# EAGLE design sensor-xmegab3 (EAGLE 6.4)
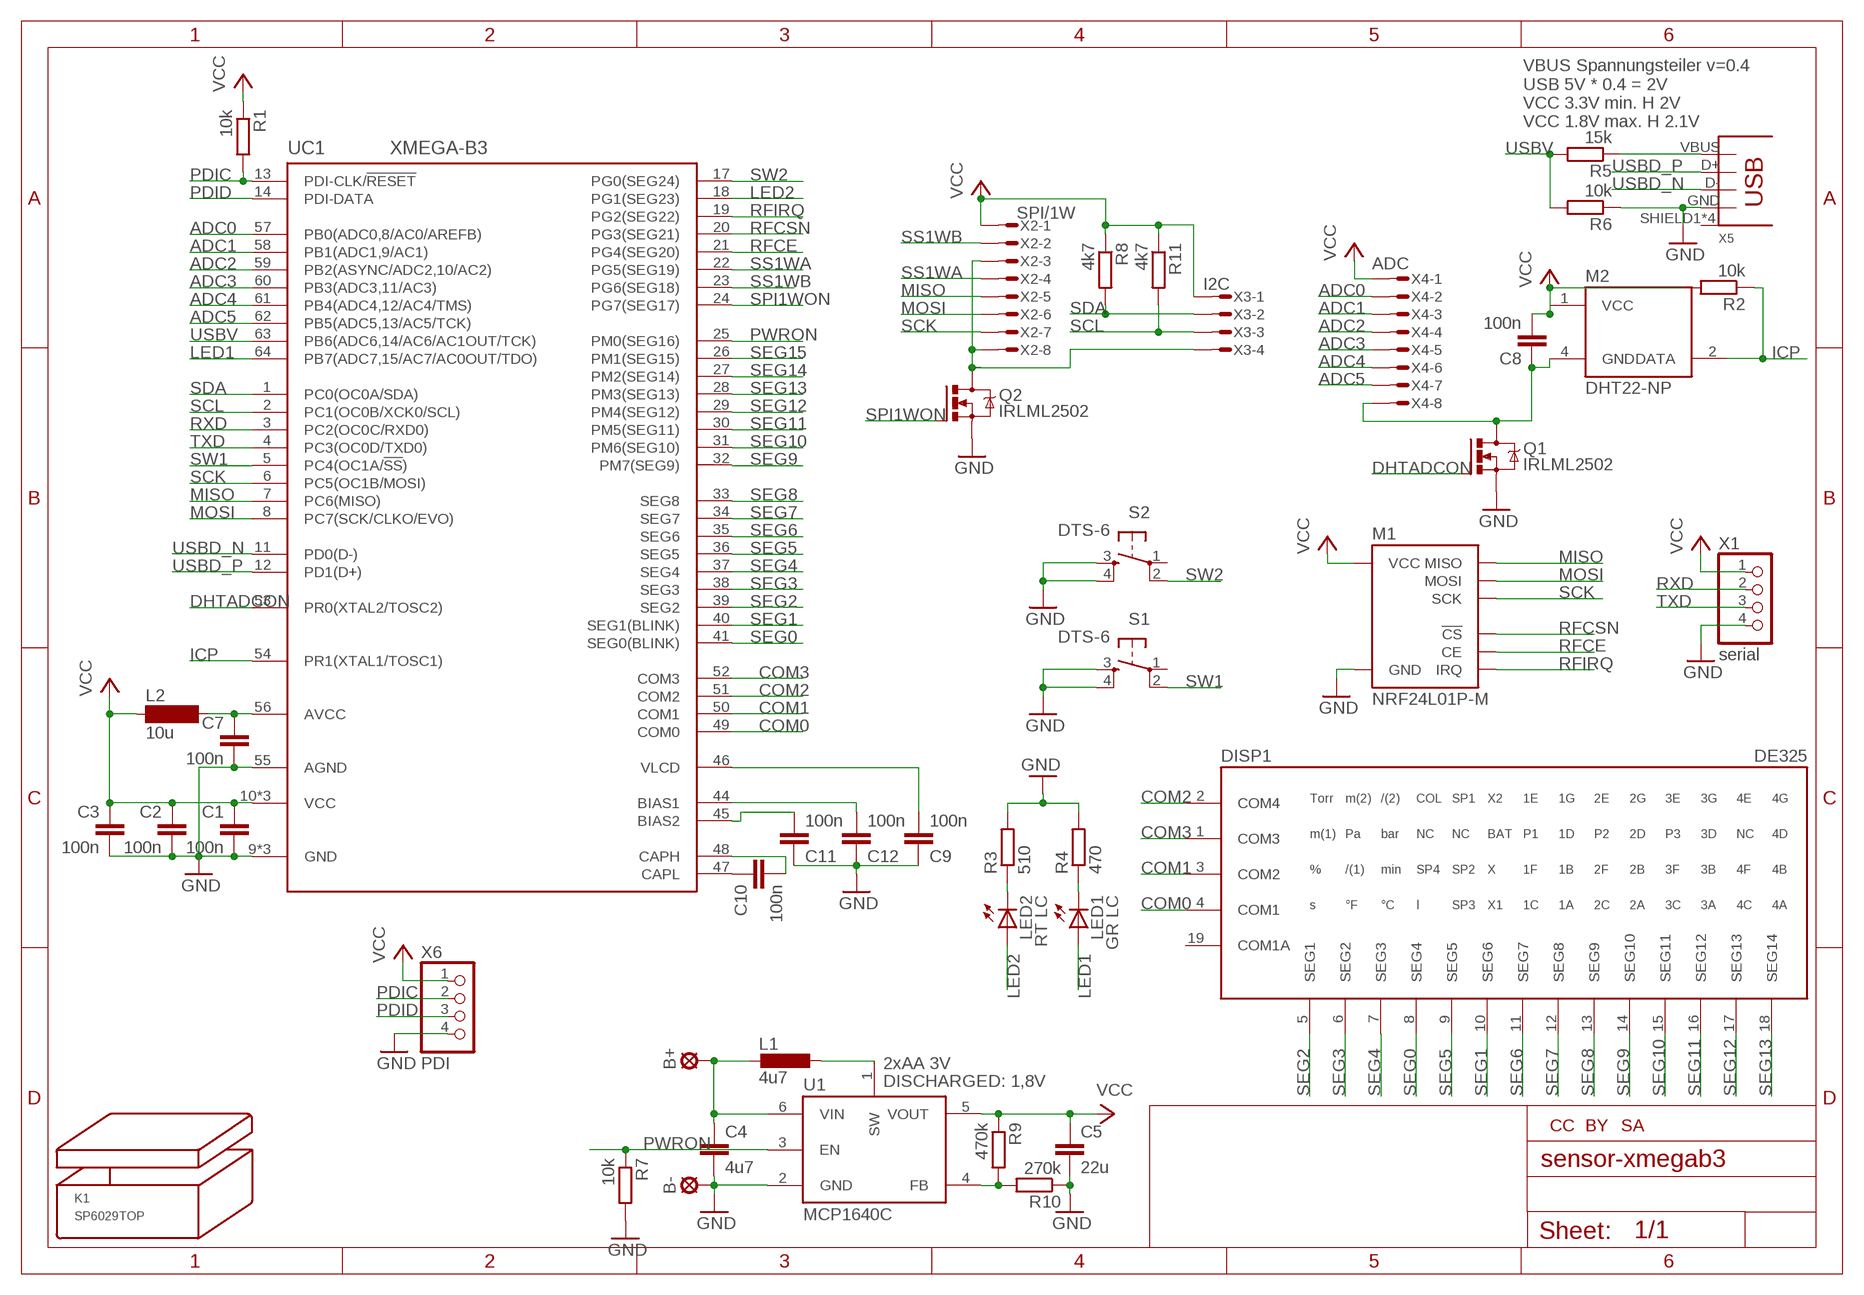
[diagram p0: schematic, sheet 1]

## Parts
B+  LSP11  [LSP11]
B-  LSP11  [LSP11]
C1  100n  C-EUC0603  [C0603]
C2  100n  C-EUC0603  [C0603]
C3  100n  C-EUC0603  [C0603]
C4  4u7  C-EUC0805  [C0805]
C5  22u  C-EUC1206  [C1206]
C7  100n  C-EUC0603  [C0603]
C8  100n  C-EUC0603  [C0603]
C9  100n  C-EUC0603  [C0603]
C10  100n  C-EUC0603  [C0603]
C11  100n  C-EUC0603  [C0603]
C12  100n  C-EUC0603  [C0603]
DISP1  DE325  [DE325]
K1  SP6029TOP  [SP6029T]
L1  4u7  L-EUPISG  [PISG]
L2  10u  SM-NE29  [SM-NE29]
LED1  GR LC  LED5MM  [LED5MM]
LED2  RT LC  LED5MM  [LED5MM]
M1  NRF24L01P-M  [NRF24L01P-A]
M2  DHT22-NP  [DHT22-NOPRINT]
Q1  IRLML2502  [MICRO3]
Q2  IRLML2502  [MICRO3]
R1  10k  R-EU_R0603  [R0603]
R2  10k  R-EU_R0603  [R0603]
R3  510  R-EU_R0805  [R0805]
R4  470  R-EU_R0805  [R0805]
R5  15k  R-EU_R0603  [R0603]
R6  10k  R-EU_R0603  [R0603]
R7  10k  R-EU_R0603  [R0603]
R8  4k7  R-EU_R0603  [R0603]
R9  470k  R-EU_R0603  [R0603]
R10  270k  R-EU_R0603  [R0603]
R11  4k7  R-EU_R0603  [R0603]
S1  DTS-6  [DTS-6]
S2  DTS-6  [DTS-6]
U1  MCP1640C  MCP1640  [SOT23-6]
U$1  CC-TPLACE-HALF  [CC_TPLACE_HS]
U$3  BY-TPLACE-HS  [BY_TPLACE_HS]
U$4  SA-TPLACE-HALF  [SA_TPLACE_HS]
UC1  XMEGA-B3  [TQFP64]
X1  serial  PINHD-1X4_2.54  [1X04]
X2  SPI/1W  MICROMATCH-8  [MICROMATCH-8]
X3  I2C  MICROMATCH-4  [MICROMATCH-4]
X4  ADC  MICROMATCH-8  [MICROMATCH-8]
X5  USB  USB-MB-S  [USB-MB-S]
X6  PDI  PINHD-1X4_2.54  [1X04]

## Nets
ADC0: UC1.57(PB0(ADC0,8/AC0/AREFB)) X4.2
ADC1: UC1.58(PB1(ADC1,9/AC1)) X4.3
ADC2: UC1.59(PB2(ASYNC/ADC2,10/AC2)) X4.4
ADC3: UC1.60(PB3(ADC3,11/AC3)) X4.5
ADC4: UC1.61(PB4(ADC4,12/AC4/TMS)) X4.6
ADC5: UC1.62(PB5(ADC5,13/AC5/TCK)) X4.7
AVCC: C7.1 L2.2 UC1.56(AVCC)
COM0: DISP1.4(COM1) UC1.49(COM0)
COM1: DISP1.3(COM2) UC1.50(COM1)
COM2: DISP1.2(COM4) UC1.51(COM2)
COM3: DISP1.1(COM3) UC1.52(COM3)
DHTADCON: Q1.1(G) UC1.53(PR0(XTAL2/TOSC2))
GND: B-.MP C1.2 C2.2 C3.2 C4.2 C5.2 C7.2 C9.1 C11.1 C12.1 M1.GND_A(GND) M1.GND_B(GND) Q1.2(S) Q2.2(S) R3.2 R4.2 R6.1 R7.2 R10.1 S1.3 S1.4 S2.3 S2.4 U1.2(GND) UC1.9(GND) UC1.15(GND) UC1.42(GND) UC1.55(AGND) X1.4 X5.GND X6.4
ICP: M2.2(DATA) R2.1 UC1.54(PR1(XTAL1/TOSC1))
LED1: LED1.A UC1.64(PB7(ADC7,15/AC7/AC0OUT/TDO))
LED2: LED2.A UC1.18(PG1(SEG23))
MISO: M1.MISO UC1.7(PC6(MISO)) X2.5
MOSI: M1.MOSI UC1.8(PC7(SCK/CLKO/EVO)) X2.6
N$1: LED1.K(C) R4.1
N$3: R5.1 X5.VBUS
N$6: LED2.K(C) R3.1
N$7: L1.1 U1.1(SW)
N$8: R9.2 R10.2 U1.4(FB)
N$9: C11.2 UC1.45(BIAS2)
N$10: C12.2 UC1.44(BIAS1)
N$11: Q2.3(D) X2.3 X2.8 X3.4
N$12: C8.1 M2.4(GND) Q1.3(D) X4.8
N$14: C9.2 UC1.46(VLCD)
N$23: C10.1 UC1.47(CAPL)
N$25: C10.2 UC1.48(CAPH)
PDIC: R1.2 UC1.13(PDI-CLK/!RESET) X6.2
PDID: UC1.14(PDI-DATA) X6.3
PWRON: R7.1 U1.3(EN) UC1.25(PM0(SEG16))
RFCE: M1.CE UC1.21(PG4(SEG20))
RFCSN: M1.CSN(!CS) UC1.20(PG3(SEG21))
RFIRQ: M1.IRQ UC1.19(PG2(SEG22))
RXD: UC1.3(PC2(OC0C/RXD0)) X1.2
SCK: M1.SCK UC1.6(PC5(OC1B/MOSI)) X2.7
SCL: R11.2 UC1.2(PC1(OC0B/XCK0/SCL)) X3.3
SDA: R8.2 UC1.1(PC0(OC0A/SDA)) X3.2
SEG0: DISP1.8(SEG4) UC1.41(SEG0(BLINK))
SEG1: DISP1.10(SEG6) UC1.40(SEG1(BLINK))
SEG2: DISP1.5(SEG1) UC1.39(SEG2)
SEG3: DISP1.6(SEG2) UC1.38(SEG3)
SEG4: DISP1.7(SEG3) UC1.37(SEG4)
SEG5: DISP1.9(SEG5) UC1.36(SEG5)
SEG6: DISP1.11(SEG7) UC1.35(SEG6)
SEG7: DISP1.12(SEG8) UC1.34(SEG7)
SEG8: DISP1.13(SEG9) UC1.33(SEG8)
SEG9: DISP1.14(SEG10) UC1.32(PM7(SEG9))
SEG10: DISP1.15(SEG11) UC1.31(PM6(SEG10))
SEG11: DISP1.16(SEG12) UC1.30(PM5(SEG11))
SEG12: DISP1.17(SEG13) UC1.29(PM4(SEG12))
SEG13: DISP1.18(SEG14) UC1.28(PM3(SEG13))
SEG14: UC1.27(PM2(SEG14))
SEG15: UC1.26(PM1(SEG15))
SPI1WON: Q2.1(G) UC1.24(PG7(SEG17))
SS1WA: UC1.22(PG5(SEG19)) X2.4
SS1WB: UC1.23(PG6(SEG18)) X2.2
SW1: S1.2 UC1.5(PC4(OC1A/!SS!))
SW2: S2.2 UC1.17(PG0(SEG24))
TXD: UC1.4(PC3(OC0D/TXD0)) X1.3
USBD_N: UC1.11(PD0(D-)) X5.D-
USBD_P: UC1.12(PD1(D+)) X5.D+
USBV: R5.2 R6.2 UC1.63(PB6(ADC6,14/AC6/AC1OUT/TCK))
VBAT: B+.MP C4.1 L1.2 U1.6(VIN)
VCC: C1.1 C2.1 C3.1 C5.1 C8.2 L2.1 M1.VCC_A(VCC) M1.VCC_B(VCC) M2.1(VCC) R1.1 R2.2 R8.1 R9.1 R11.1 U1.5(VOUT) UC1.10(VCC) UC1.16(VCC) UC1.43(VCC) X1.1 X2.1 X3.1 X4.1 X6.1
Unconnected: DISP1.19(COM1A) S1.1 S2.1 X5.SHIELD1(SHIELD) X5.SHIELD2(SHIELD) X5.SHIELD3(SHIELD) X5.SHIELD4(SHIELD)

## Notes on the sheet
- VBUS Spannungsteiler v=0.4
  USB 5V * 0.4 = 2V
  VCC 3.3V min. H 2V
  VCC 1.8V max. H 2.1V
- 2xAA 3V
- DISCHARGED: 1,8V

## Library data of the parts
B+ B- = solpad:LSP11: SOLDER PAD drill 1.1 mm
C1-C3 C7-C12 = rcl:C-EU: CAPACITOR, European symbol
C4 = rcl:C-EU: CAPACITOR, European symbol; _REICHELT_: X7R-G0805 4,7/16
C5 = rcl:C-EU: CAPACITOR, European symbol; _REICHELT_: X7R-G1206 22/10
DISP1 = lcd_displays:DE325: Display Elektronik GmbH DE325-Series Datasheet: http://display-elektronik.de/DE325-RS-20_843V.PDF
K1 = strapubox:SP6029: Gehäuse Strapubox Typ 6029 Montage Deckel max. Bauteilhöhe, top-layer: 7,5 mm max. Bauteilhöhe, bottom-layer: 10 mm (Dicke der LP: 1,5 mm) Montage Boden max. Bauteilhöhe, top-layer: 12,5 mm max. Bauteilhöhe, bottom-layer: 5 mm (Dicke der LP: 1,5 mm) Außenmaße: Länge: 80 mm Breite: 61 mm Höhe: 23 mm Innenmaße: Länge: 75 mm Breite: 56 mm Höhe: 19 mm Mit Batteriefach 2xAA/9V
L1 = inductor-Fastron:L-EU; _REICHELT_: L-PISG 4,7µ
L2 = inductor-neosid:SM-NE29: INDUCTOR SMD chip inductor; OC_FARNELL: unknown; OC_NEWARK: unknown
LED1 = led:LED: LED OSRAM: - CHIPLED LG R971, LG N971, LY N971, LG Q971, LY Q971, LO R971, LY R971 LH N974, LH R974 LS Q976, LO Q976, LY Q976 LO Q996 - Hyper CHIPLED LW Q18S LB Q993, LB Q99A, LB R99A - SideLED LS A670, LO A670, LY A670, LG A670, LP A670 LB A673, LV A673, LT A673, LW A673 LH A674 LY A675 LS A676, LA A676, LO A676, LY A676, LW A676 LS A679, LY A679, LG A679 - Hyper Micro SIDELED® LS Y876, LA Y876, LO Y876, LY Y876 LT Y87S - SmartLED LW L88C, LW L88S LB L89C, LB L89S, LG L890 LS L89K, LO L89K, LY L89K LS L896, LA L896, LO L896, LY L896 - TOPLED LS T670, LO T670, LY T670, LG T670, LP T670 LSG T670, LSP T670, LSY T670, LOP T670, LYG T670 LG T671, LOG T671, LSG T671 LB T673, LV T673, LT T673, LW T673 LH T674 LS T676, LA T676, LO T676, LY T676, LB T676, LH T676, LSB T676, LW T676 LB T67C, LV T67C, LT T67C, LS T67K, LO T67K, LY T67K, LW E67C LS E67B, LA E67B, LO E67B, LY E67B, LB E67C, LV E67C, LT E67C LW T67C LS T679, LY T679, LG T679 LS T770, LO T770, LY T770, LG T770, LP T770 LB T773, LV T773, LT T773, LW T773 LH T774 LS E675, LA E675, LY E675, LS T675 LS T776, LA T776, LO T776, LY T776, LB T776 LHGB T686 LT T68C, LB T68C - Hyper Mini TOPLED® LB M676 - Mini TOPLED Santana® LG M470 LS M47K, LO M47K, LY M47K Source: http://www.osram.convergy.de LUXEON: - LUMILED® LXK2-PW12-R00, LXK2-PW12-S00, LXK2-PW14-U00, LXK2-PW14-V00 LXK2-PM12-R00, LXK2-PM12-S00, LXK2-PM14-U00 LXK2-PE12-Q00, LXK2-PE12-R00, LXK2-PE12-S00, LXK2-PE14-T00, LXK2-PE14-U00 LXK2-PB12-K00, LXK2-PB12-L00, LXK2-PB12-M00, LXK2-PB14-N00, LXK2-PB14-P00, LXK2-PB14-Q00 LXK2-PR12-L00, LXK2-PR12-M00, LXK2-PR14-Q00, LXK2-PR14-R00 LXK2-PD12-Q00, LXK2-PD12-R00, LXK2-PD12-S00 LXK2-PH12-R00, LXK2-PH12-S00 LXK2-PL12-P00, LXK2-PL12-Q00, LXK2-PL12-R00 Source: www.luxeon.com KINGBRIGHT: KA-3528ASYC Source: www.kingbright.com; I: 2.2mA; U_F: 2V2
LED2 = led:LED: LED OSRAM: - CHIPLED LG R971, LG N971, LY N971, LG Q971, LY Q971, LO R971, LY R971 LH N974, LH R974 LS Q976, LO Q976, LY Q976 LO Q996 - Hyper CHIPLED LW Q18S LB Q993, LB Q99A, LB R99A - SideLED LS A670, LO A670, LY A670, LG A670, LP A670 LB A673, LV A673, LT A673, LW A673 LH A674 LY A675 LS A676, LA A676, LO A676, LY A676, LW A676 LS A679, LY A679, LG A679 - Hyper Micro SIDELED® LS Y876, LA Y876, LO Y876, LY Y876 LT Y87S - SmartLED LW L88C, LW L88S LB L89C, LB L89S, LG L890 LS L89K, LO L89K, LY L89K LS L896, LA L896, LO L896, LY L896 - TOPLED LS T670, LO T670, LY T670, LG T670, LP T670 LSG T670, LSP T670, LSY T670, LOP T670, LYG T670 LG T671, LOG T671, LSG T671 LB T673, LV T673, LT T673, LW T673 LH T674 LS T676, LA T676, LO T676, LY T676, LB T676, LH T676, LSB T676, LW T676 LB T67C, LV T67C, LT T67C, LS T67K, LO T67K, LY T67K, LW E67C LS E67B, LA E67B, LO E67B, LY E67B, LB E67C, LV E67C, LT E67C LW T67C LS T679, LY T679, LG T679 LS T770, LO T770, LY T770, LG T770, LP T770 LB T773, LV T773, LT T773, LW T773 LH T774 LS E675, LA E675, LY E675, LS T675 LS T776, LA T776, LO T776, LY T776, LB T776 LHGB T686 LT T68C, LB T68C - Hyper Mini TOPLED® LB M676 - Mini TOPLED Santana® LG M470 LS M47K, LO M47K, LY M47K Source: http://www.osram.convergy.de LUXEON: - LUMILED® LXK2-PW12-R00, LXK2-PW12-S00, LXK2-PW14-U00, LXK2-PW14-V00 LXK2-PM12-R00, LXK2-PM12-S00, LXK2-PM14-U00 LXK2-PE12-Q00, LXK2-PE12-R00, LXK2-PE12-S00, LXK2-PE14-T00, LXK2-PE14-U00 LXK2-PB12-K00, LXK2-PB12-L00, LXK2-PB12-M00, LXK2-PB14-N00, LXK2-PB14-P00, LXK2-PB14-Q00 LXK2-PR12-L00, LXK2-PR12-M00, LXK2-PR14-Q00, LXK2-PR14-R00 LXK2-PD12-Q00, LXK2-PD12-R00, LXK2-PD12-S00 LXK2-PH12-R00, LXK2-PH12-S00 LXK2-PL12-P00, LXK2-PL12-Q00, LXK2-PL12-R00 Source: www.luxeon.com KINGBRIGHT: KA-3528ASYC Source: www.kingbright.com; I: 2mA; U_F: 2V
M1 = modules:NRF24L01P-M
M2 = modules:DHT22
Q1 Q2 = mosfet:IRLML2502: HEXFET N-Channel Power MOSFET http://www.irf.com/product-info/datasheets/data/irlml2502.pdf
R1-R11 = rcl:R-EU_: RESISTOR, European symbol
S1 S2 = switch-tact:DTS-6
U1 = karlnet-parts:MCP1640: MCP1623, 1624, 1640/B/C/D pwm/pfm or pwm only DC/DC converters, in SOT-23
U$1 = creative-commons:CC: creatice commons - CC
U$3 = creative-commons:BY: creative commons Attribution - BY
U$4 = creative-commons:SA: creative commons ShareAlike - SA
UC1 = avr-7:XMEGA-B3: Atmel XMega B3 series processor
X1 X6 = pinhead-mod:PINHD-1X4: PIN HEADER
X2 X4 = con-amp-micromatch:MICROMATCH-8: MicroMaTch 8 7-215464-8 / 0-215464-8 Drawing Number C-215464 DDEController.pdf
X3 = con-amp-micromatch:MICROMATCH-4: MicroMaTch 4 7-215464-4 / 0-215464-4 Drawing Number C-215464 DDEController.pdf
X5 = con-usb:USB: USB Connectors

## Board
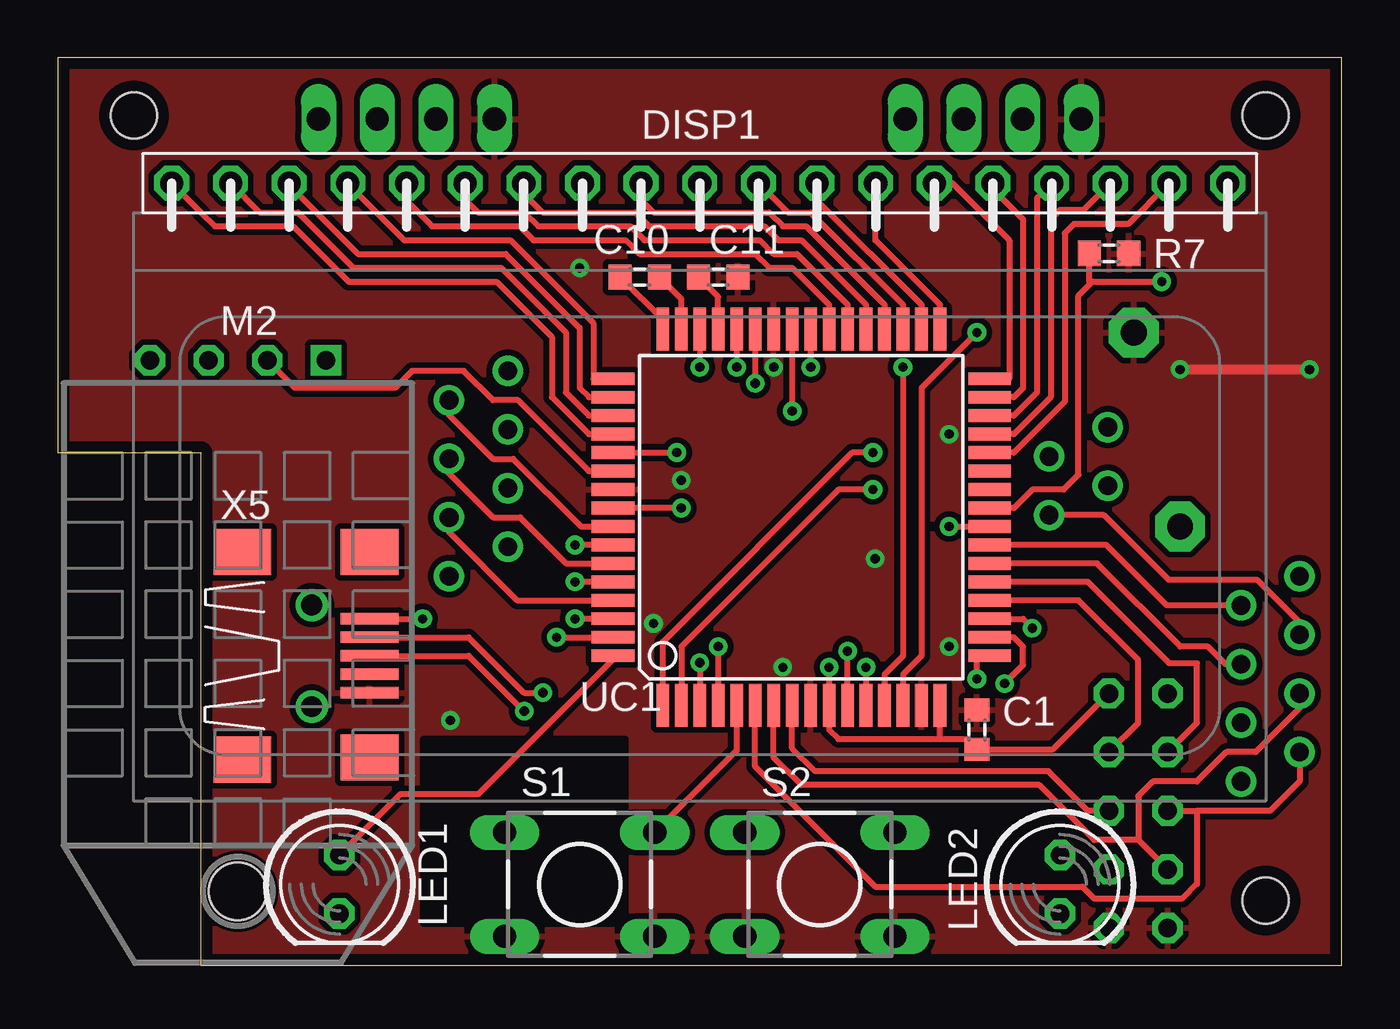
[diagram p1: board, top side]
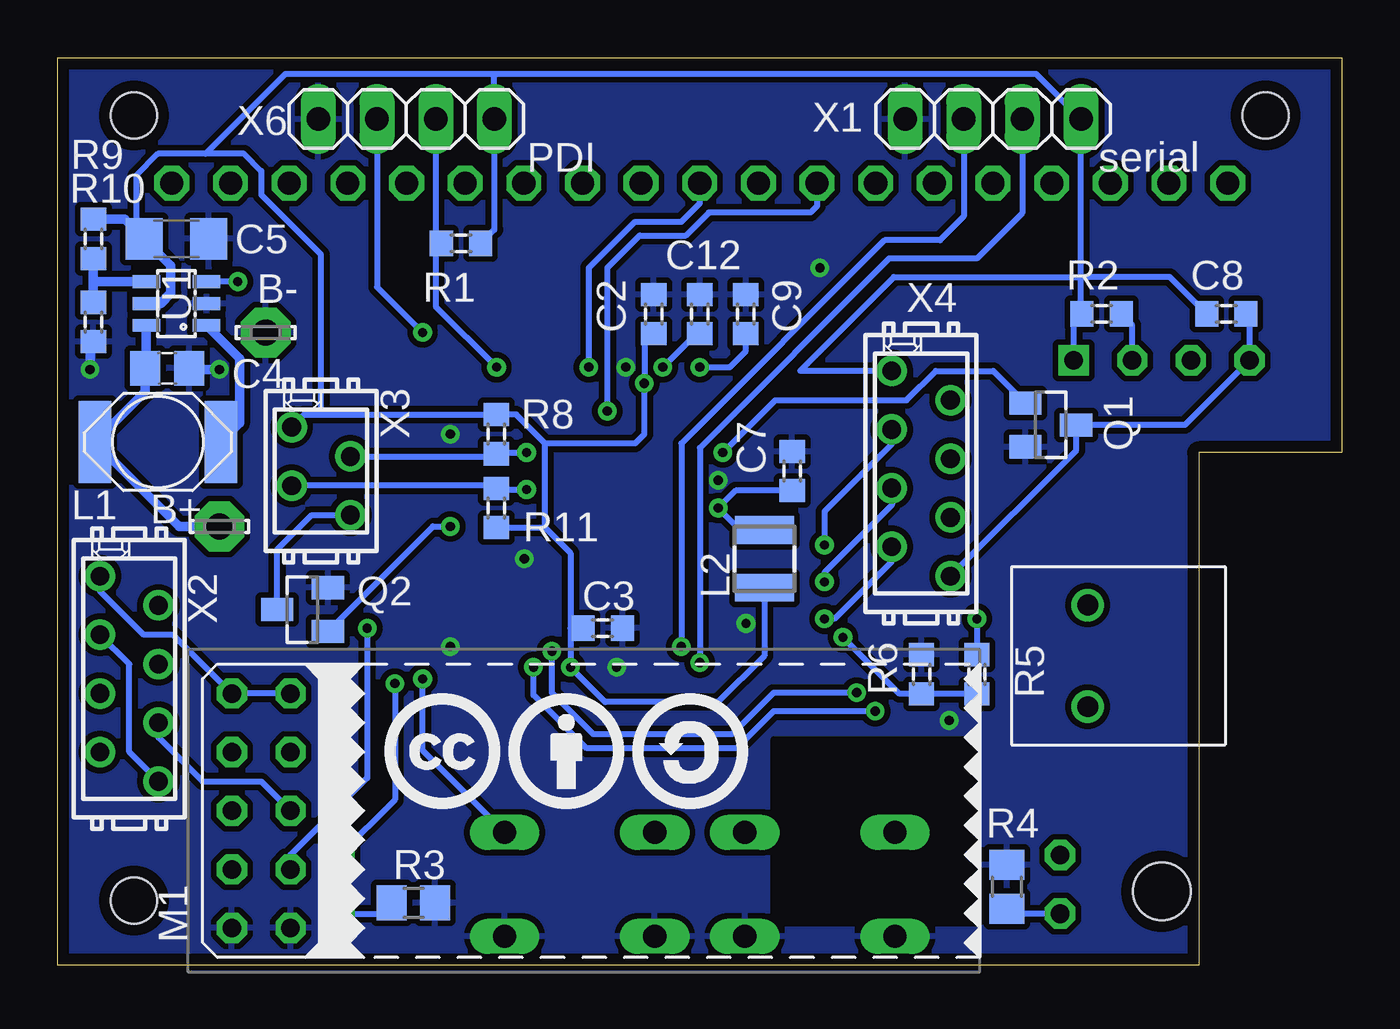
[diagram p2: board, bottom side, seen from below]

Size 55.6 x 39.3 mm. Coordinates in mm from the lower left corner, seen from the top.
Outline: 6.2,22.2 6.2,0 55.6,0 55.6,39.3 0,39.3 0,22.2 6.2,22.2
Copper layers (1*16): Top 0.035mm / dielectric 1.5mm / Bottom 0.035mm
Design rules "bilex-cust *": minimum track width 10mil, minimum drill 0.4mm, track to track 10mil, track to pad 10mil, pad to pad 0.251459375mm, via to via 10mil, smd to smd 0.251459375mm, copper to edge 0.5mm, drill to drill 8mil, minimum pad ring 10mil, minimum via ring 8mil, stop-mask expansion 4mil, vias tented up to drill 0mil, thermal gap 10mil
Holes 2 mm at 52.3,2.8 52.3,36.8 3.3,36.8
Holes 2.5 mm at 7.8,3.2

### Footprints (pad centres in the part's own frame; a part is rotated, then mirrored left to right if it is on the bottom)
LSP11 = drill 1.118 pad 2.159 octagon: MP 0,0
C0603 = smd 1 x 1.1: 1 -0.85,0; 2 0.85,0
C0805 = smd 1.3 x 1.5: 1 -0.95,0; 2 0.95,0
C1206 = smd 1.6 x 1.8: 1 -1.4,0; 2 1.4,0
DE325 = drill 1 octagon: 1 -22.86,1.27; 2 -20.32,1.27; 3 -17.78,1.27; 4 -15.24,1.27; 5 -12.7,1.27; 6 -10.16,1.27; 7 -7.62,1.27; 8 -5.08,1.27; 9 -2.54,1.27; 10 0,1.27; 11 2.54,1.27; 12 5.08,1.27; 13 7.62,1.27; 14 10.16,1.27; 15 12.7,1.27; 16 15.24,1.27; 17 17.78,1.27; 18 20.32,1.27; 19 22.86,1.27
PISG = smd 1.4 x 3.56: 1 -2.73,0; 2 2.73,0
SM-NE29 = smd 1.2 x 2.54: 1 -1.25,0; 2 1.25,0
LED5MM = drill 0.813 octagon: A -1.27,0; K 1.27,0
NRF24L01P-A = drill 0.8 octagon: CE -2.54,-1.27; CSN -2.54,1.27; GND_A 5.08,1.27; GND_B 5.08,-1.27; IRQ 2.54,1.27; MISO 2.54,-1.27; MOSI 0,1.27; SCK 0,-1.27; VCC_A -5.08,1.27; VCC_B -5.08,-1.27
DHT22-NOPRINT = drill 0.8 square: 1 -3.81,0 | drill 0.8 octagon: 2 -1.27,0; 3 1.27,0; 4 3.81,0
MICRO3 = smd 1 x 1.4: 1 -0.95,-1.1; 2 0.95,-1.1; 3 0,1.1
R0603 = smd 1 x 1.1: 1 -0.85,0; 2 0.85,0
R0805 = smd 1.3 x 1.5: 1 -0.95,0; 2 0.95,0
DTS-6 = drill 1 long: 1 -3.25,2.25; 2 3.25,2.25; 3 -3.25,-2.25; 4 3.25,-2.25
SOT23-6 = smd 0.55 x 1.2: 1 -0.95,-1.3; 2 0,-1.3; 3 0.95,-1.3; 4 0.95,1.3; 5 0,1.3; 6 -0.95,1.3
TQFP64 = smd 1.85 x 0.55: 1 -8.15,6; 2 -8.15,5.2; 3 -8.15,4.4; 4 -8.15,3.6; 5 -8.15,2.8; 6 -8.15,2; 7 -8.15,1.2; 8 -8.15,0.4; 9 -8.15,-0.4; 10 -8.15,-1.2; 11 -8.15,-2; 12 -8.15,-2.8; 13 -8.15,-3.6; 14 -8.15,-4.4; 15 -8.15,-5.2; 16 -8.15,-6; 33 8.15,-6; 34 8.15,-5.2; 35 8.15,-4.4; 36 8.15,-3.6; 37 8.15,-2.8; 38 8.15,-2; 39 8.15,-1.2; 40 8.15,-0.4; 41 8.15,0.4; 42 8.15,1.2; 43 8.15,2; 44 8.15,2.8; 45 8.15,3.6; 46 8.15,4.4; 47 8.15,5.2; 48 8.15,6 | smd 0.55 x 1.85: 17 -6,-8.15; 18 -5.2,-8.15; 19 -4.4,-8.15; 20 -3.6,-8.15; 21 -2.8,-8.15; 22 -2,-8.15; 23 -1.2,-8.15; 24 -0.4,-8.15; 25 0.4,-8.15; 26 1.2,-8.15; 27 2,-8.15; 28 2.8,-8.15; 29 3.6,-8.15; 30 4.4,-8.15; 31 5.2,-8.15; 32 6,-8.15; 49 6,8.15; 50 5.2,8.15; 51 4.4,8.15; 52 3.6,8.15; 53 2.8,8.15; 54 2,8.15; 55 1.2,8.15; 56 0.4,8.15; 57 -0.4,8.15; 58 -1.2,8.15; 59 -2,8.15; 60 -2.8,8.15; 61 -3.6,8.15; 62 -4.4,8.15; 63 -5.2,8.15; 64 -6,8.15
1X04 = drill 1.016 long: 1 -3.81,0; 2 -1.27,0; 3 1.27,0; 4 3.81,0
MICROMATCH-8 = drill 0.813: 1 4.445,1.27; 2 3.175,-1.27; 3 1.905,1.27; 4 0.635,-1.27; 5 -0.635,1.27; 6 -1.905,-1.27; 7 -3.175,1.27; 8 -4.445,-1.27
MICROMATCH-4 = drill 0.813: 1 1.905,1.27; 2 0.635,-1.27; 3 -0.635,1.27; 4 -1.905,-1.27
USB-MB-S = smd 2.5 x 0.5: D+ 2.5,0; D- 2.5,0.8; GND 2.5,-1.6; ID 2.5,-0.8; VBUS 2.5,1.6 | drill 0.9: P$5 0,2.2; P$6 0,-2.2 | smd 2.5 x 2: SHIELD1 -3,4.5; SHIELD2 2.5,4.5; SHIELD3 -3,-4.5; SHIELD4 2.5,-4.4

### Placement (x,y rotation side)
B+  48.6,19 180 bottom
B-  46.6,27.4 0 bottom
C1  39.8,10.2 90 top
C2  29.8,28.2 90 bottom
C3  32,14.6 0 bottom
C4  50.86,25.86 0 bottom
C5  50.46,31.46 0 bottom
C7  23.8,21.4 90 bottom
C8  5,28.2 180 bottom
C9  25.8,28.2 270 bottom
C10  25.2,29.8 180 top
C11  28.6,29.8 180 top
C12  27.8,28.2 270 bottom
DISP1  27.8,32.6 0 top
K1  -0.2,-2.2 0 top
L1  51.26,22.66 180 bottom
L2  25,17.6 90 bottom
LED1  12.2,3.5 270 top
LED2  43.4,3.5 270 top
M1  46.79,6.69 270 bottom
M2  7.8,26.2 180 top
Q1  12.6,23.4 270 bottom
Q2  45,15.4 90 bottom
R1  38.14,31.26 180 bottom
R2  10.4,28.2 180 bottom
R3  40.2,2.7 0 bottom
R4  14.5,3.4 90 bottom
R5  15.8,12.6 270 bottom
R6  18.2,12.6 270 bottom
R7  45.52,30.82 0 top
R8  36.6,23 270 bottom
R9  54.06,31.46 270 bottom
R10  54.06,27.86 90 bottom
R11  36.6,19.8 90 bottom
S1  22.6,3.5 0 top
S2  33,3.5 0 top
U1  50.46,28.66 90 bottom
U$1  41.45,6.76 0 bottom
U$3  36.08,6.76 0 bottom
U$4  30.71,6.76 0 bottom
UC1  32.2,19.4 90 top
X1  15.1,36.64 180 bottom
X2  52.5,12.41 90 bottom
X3  44.2,21.4 90 bottom
X4  18.21,21.3 90 bottom
X5  11,13.4 0 top
X6  40.51,36.64 180 bottom

### Tracks (layer width: path | path; a pad name or v marks a point on that pad's centre or on a via)
ADC0
  Top 0.254: X4.2 16.95,23.84 18.85,21.93 19.72,21.93 22.65,19 UC1.57
ADC1  (via drill 0.4)
  Top 0.254: UC1.58 v22.4,18.2
  Bottom 0.254: X4.3 19.48,22.57 22.4,19.65 v22.4,18.2
ADC2
  Top 0.254: UC1.59 22.01,17.4 20.02,19.39 18.85,19.39 16.95,21.3 X4.4
ADC3  (via drill 0.4)
  Top 0.254: UC1.60 v22.4,16.6
  Bottom 0.254: X4.5 19.48,19.93 22.4,17.01 v22.4,16.6
ADC4
  Top 0.254: X4.6 16.95,18.75 19.9,15.8 UC1.61
ADC5  (via drill 0.4)
  Top 0.254: UC1.62 v22.4,15
  Bottom 0.254: X4.7 19.48,17.48 21.97,15 v22.4,15
AVCC  (via drill 0.4)
  Top 0.254: v27,19.8 UC1.56
  Bottom 0.254: C7.1 26.25,20.55 v27,19.8 26.05,18.85 L2.2
COM0
  Top 0.254: UC1.49 23.2,25.4 23.2,27.8 19.6,31.4 15,31.4 12.56,33.84 DISP1.4
COM1
  Top 0.254: UC1.50 23,24.6 22.6,25 22.6,27.6 19.4,30.8 13,30.8 10.02,33.78 DISP1.3
COM2
  Top 0.254: UC1.51 23,23.8 22,24.8 22,27.4 19.2,30.2 12.8,30.2 10.4,32.6 8.75,32.6 DISP1.2
COM3
  Top 0.254: DISP1.1 6.21,32.6 6.2,32.6 6.8,32 10.2,32 12.6,29.6 19,29.6 21.4,27.2 21.4,24.6 23,23 UC1.52
DHTADCON  (via drill 0.4)
  Top 0.254: UC1.53 v26.8,22.2
  Bottom 0.254: Q1.1 15.09,25.74 17.58,25.74 18.85,24.47 24.53,24.47 v26.8,22.2
GND  (via drill 0.4)
  Top 0.406: v54.2,25.8 v48.6,25.8
  Bottom 0.406: R10.1 54.2,26.87 v54.2,25.8 | v48.6,25.8 49.85,25.8 C4.2
  other vias: 31,25.9 27,21 31.4,12.9 38.6,13.8 38.6,23 35.4,17.6 25.8,14.8 17,10.6 22.6,30.2
  pour Bottom: -0.3,40.44 56.22,40.44 56.22,-0.93 -0.3,-0.93
  pour Top: -0.93,41.07 56.85,41.07 56.85,-1.57 -0.93,-1.57
ICP
  Top 0.254: M2.2 10.27,25 14.6,25 15.34,25.74 17.58,25.74 18.85,24.47 19.93,24.47 23,21.4 UC1.54
  Bottom 0.254: M2.2 9.07,27.72 R2.1
LED1
  Top 0.254: UC1.64 24.05,13.25 18.2,7.4 14.83,7.4 LED1.A
LED2  (via drill 0.4)
  Top 0.254: v41,12.2 41.8,13 41.8,13.8 41.4,14.2 UC1.18
  Bottom 0.254: v41,12.2 41,7.17 LED2.A
MISO
  Top 0.254: M1.MISO 46.79,5.42 | 46.79,5.42 44.88,5.42 42.5,7.8 32.2,7.8 31,9 UC1.7 | X2.5 53.77,11.14 51.87,9.23 50.6,9.23 49.33,7.96 47.42,7.96 46.79,7.33 46.79,5.42
MOSI
  Top 0.254: M1.MOSI 44.61,6.69 42.9,8.4 32.8,8.4 31.8,9.4 UC1.8
  Bottom 0.254: X2.6 51.23,9.86 49.33,7.96 46.79,7.96 M1.MOSI
N$1
  Bottom 0.254: LED1.K 14.28,2.23 R4.1
N$2
  cutout Top: 15.8,9.8 15.8,1.8 24.6,1.8 24.6,9.8
N$3  (via drill 0.4)
  Top 0.254: X5.VBUS v15.8,15
  Bottom 0.254: v15.8,15 R5.1
N$5
  cutout Bottom: 15.8,9.8 15.8,1.8 24.6,1.8 24.6,9.8
N$6
  Bottom 0.254: LED2.K 41.62,2.23 R3.1
N$7
  Bottom 0.406: U1.1 47.73,26.28 47.73,23.47 L1.1
N$8
  Bottom 0.406: R10.2 54.06,29.61 | 54.06,29.61 R9.2 | U1.4 54.06,29.61
N$9
  Top 0.254: UC1.45 28.6,28.95 C11.2
N$10  (via drill 0.4)
  Top 0.254: UC1.44 v29.4,25.9
  Bottom 0.254: v29.4,25.9 27.95,27.35 C12.2
N$11
  Top 0.254: X3.4 45.3,19.5 48.1,16.7 51.92,16.7 53.77,14.85 X2.3
  Bottom 0.254: X2.8 52.5,9.23 52.5,13.04 X2.3 | Q2.3 46.1,18 44.6,19.5 X3.4
N$12
  Bottom 0.254: C8.1 3.99,28.04 M2.4 6.79,23.4 Q1.3 11.5,22.3 X4.8
N$14  (via drill 0.4)
  Top 0.254: UC1.46 v27.8,25.9
  Bottom 0.254: v27.8,25.9 26.5,25.9 25.8,26.6 C9.2
N$23
  Top 0.254: UC1.47 27,28.85 C10.1
N$25
  Top 0.254: 26.2,27 UC1.48 26.2,27.95 C10.2
PDIC  (via drill 0.4)
  Top 0.254: v36.6,25.9 36.6,13.4 35.8,12.6 UC1.13
  Bottom 0.254: 39.23,30.82 39.23,31.4 39.13,31.4 R1.2 | 39.23,30.82 39.23,28.53 v36.6,25.9 | X6.2 39.24,30.83 39.23,30.82
PDID  (via drill 0.4)
  Top 0.254: v39.8,27.4 37.4,25 37.4,13.4 36.6,12.6 UC1.14
  Bottom 0.254: v39.8,27.4 41.78,29.38 X6.3
PWRON  (via drill 0.4)
  Top 0.254: 44.8,29.61 44.2,29 44.2,21.25 43.55,20.6 42.2,20.6 41.4,19.8 UC1.25 | 44.8,29.61 v47.8,29.61 | 44.8,29.61 44.67,29.61 R7.1
  Bottom 0.254: v47.8,29.61 U1.3
RFCE
  Top 0.254: M1.CE 49.33,10.5 49.33,13.07 48.13,13.07 47.8,13.4 44.6,16.6 UC1.21
RFCSN
  Top 0.254: M1.CSN 46.79,10.5 46.79,13.21 44.2,15.8 UC1.20
RFIRQ  (via drill 0.4)
  Top 0.254: UC1.19 41.8,15 v42.2,14.6
  Bottom 0.254: v42.2,14.6 42.2,8.11 45.52,4.79 M1.IRQ
RXD  (via drill 0.4)
  Top 0.254: v27.8,13.1 UC1.3
  Bottom 0.254: X1.2 13.83,32.57 15.8,30.6 19.6,30.6 27.8,22.4 v27.8,13.1
SCK
  Top 0.254: M1.SCK 49.33,6.69 | 49.33,6.69 49.33,3.51 48.7,2.88 44.88,2.88 44.36,3.4 35.4,3.4 30.2,8.6 UC1.6 | X2.7 53.77,7.96 52.5,6.69 49.33,6.69
SCL  (via drill 0.4)
  Top 0.254: UC1.2 27,13.8 33.8,20.6 v35.3,20.6
  Bottom 0.254: 36.48,20.77 X3.3 | 36.48,20.77 R11.2 | 36.48,20.77 36.32,20.6 v35.3,20.6
SDA  (via drill 0.4)
  Top 0.254: UC1.1 26.2,14 34.4,22.2 v35.3,22.2
  Bottom 0.254: X3.2 36.48,22.04 | 36.48,22.04 R8.2 | 36.48,22.04 36.32,22.2 v35.3,22.2
SEG0  (via drill 0.4)
  Top 0.254: UC1.41 v31.8,24
  Bottom 0.254: v31.8,24 31.8,30.2 30.4,31.6 28.4,31.6 27.4,32.6 23,32.6 22.72,32.88 DISP1.8
SEG1  (via drill 0.4)
  Top 0.254: UC1.40 v32.6,25.9
  Bottom 0.254: v32.6,25.9 32.6,30.2 30.6,32.2 28.6,32.2 27.8,33 DISP1.10
SEG2
  Top 0.254: DISP1.5 15.1,33.1 16.2,32 20,32 20.6,31.4 24.6,31.4 25.2,30.8 30.2,30.8 30.8,30.2 31.8,30.2 33.4,28.6 UC1.39
SEG3
  Top 0.254: DISP1.6 17.64,33.16 18.2,32.6 20.2,32.6 20.8,32 24.8,32 25.4,31.4 30.4,31.4 31,30.8 32,30.8 34.2,28.6 UC1.38
SEG4
  Top 0.254: DISP1.7 20.18,33.42 21,32.6 25,32.6 25.6,32 30.6,32 31.2,31.4 32.2,31.4 35,28.6 UC1.37
SEG5
  Top 0.254: DISP1.9 25.26,33.14 25.8,32.6 30.8,32.6 31.4,32 32.4,32 35.8,28.6 UC1.36
SEG6
  Top 0.254: 36.6,27 UC1.35 36.6,28.6 32.6,32.6 31.6,32.6 31.6,32.61 DISP1.11
SEG7
  Top 0.254: DISP1.12 32.88,33.12 37.4,28.6 UC1.34
SEG8
  Top 0.254: UC1.33 38.2,28.6 35.4,31.4 35.4,33.85 DISP1.13
SEG9
  Top 0.254: DISP1.14 38.73,33.87 41.2,31.4 41.2,25.4 UC1.32
SEG10
  Top 0.254: DISP1.15 40.5,33.6 41.8,32.3 41.8,25 41.4,24.6 UC1.31
SEG11
  Top 0.254: DISP1.16 42.4,33.23 42.4,24.8 41.4,23.8 UC1.30
SEG12
  Top 0.254: DISP1.17 44.41,32.7 43.4,32.7 43,32.3 43,24.6 41.4,23 UC1.29
SEG13
  Top 0.254: DISP1.18 46.35,32.1 44,32.1 43.6,31.7 43.6,24.4 41.4,22.2 UC1.28
SPI1WON  (via drill 0.4)
  Top 0.254: v38.6,19 UC1.24
  Bottom 0.254: 43.55,14.45 Q2.1 39.35,19 v38.6,19
SS1WA
  Top 0.254: X2.4 50.56,13.04 49.8,13.8 48.6,13.8 45,17.4 UC1.22
SS1WB
  Top 0.254: X2.2 48.02,15.58 45.4,18.2 UC1.23
SW1
  Top 0.254: UC1.5 29.4,9.3 S1.2
SW2  (via drill 0.4)
  Top 0.254: v39.8,12.4 39.8,13.4 UC1.17
  Bottom 0.254: S2.2 39.8,9.3 v39.8,12.4
TXD  (via drill 0.4)
  Top 0.254: v28.6,13.8 UC1.4
  Bottom 0.254: X1.3 16.37,32.43 17.4,31.4 19.8,31.4 28.6,22.6 v28.6,13.8
USBD_N  (via drill 0.4)
  Top 0.254: X5.D- 17.8,14.2 20.2,11.8 v21,11.8 | UC1.11 v34.2,13.6
  Bottom 0.254: v21,11.8 24.6,11.8 26.4,10 32.4,10 34.2,11.8 v34.2,13.6
USBD_P  (via drill 0.4)
  Top 0.254: X5.D+ 17.8,13.4 v20.2,11 | v35,12.9 UC1.12
  Bottom 0.254: v20.2,11 24.6,11 26.2,9.4 32.7,9.4 35,11.7 v35,12.9
USBV  (via drill 0.4)
  Top 0.254: v21.6,14.2 UC1.63
  Bottom 0.254: R5.2 R6.2 19.15,11.75 v21.6,14.2
VBAT
  Bottom 0.406: U1.6 51.76,25.91 C4.1 51.81,24.84 L1.2 50.33,19 B+.MP
VCC  (via drill 0.4)
  Top 0.254: 38.2,9.8 33.8,9.8 33.4,10.2 UC1.10 v33.4,12.9 | 38.2,9.8 39.35,9.8 C1.1 43.1,9.35 M1.VCC_A | 38.2,9.8 UC1.16 | UC1.43 v30.2,25.2
  Bottom 0.254: M1.VCC_A M1.VCC_B 50.6,14.31 51.87,14.31 53.77,16.21 X2.1 | M2.1 11.61,27.84 R2.2 11.29,28.24 11.29,29.8 | 11.29,29.8 X1.1 13.25,38.6 36.6,38.6 | C8.2 7.45,29.8 11.29,29.8 | 11.29,29.8 19.4,29.8 23.46,25.74 X4.1 | 51.23,31.46 C5.1 52.2,31.79 52.2,34.2 51.26,35.14 49.2,35.14 | 36.69,31.86 36.7,31.85 | 36.7,31.85 R1.1 | 34.5,22.6 30.6,22.6 30.2,23 v30.2,25.2 30.2,26.95 C2.1 | 34.5,22.6 35.75,23.85 R8.1 44.2,23.85 | R11.1 34.5,18.95 | 34.5,18.95 34.5,22.6 | X3.1 44.92,23.85 44.2,23.85 | 33.4,14.6 33.4,17.85 34.5,18.95 | 33.4,14.6 v33.4,12.9 31.9,11.4 27,11.4 25,13.4 L2.1 | 44.2,23.85 44.2,30.77 46.79,33.36 46.79,34.39 47.54,35.14 49.2,35.14 | C3.1 33.4,14.6 | 36.7,31.85 X6.1 36.7,38.5 36.6,38.6 | 49.2,35.14 45.73,38.6 36.6,38.6
  Bottom 0.406: U1.5 51.14,28.66 50.7,29.1 50.7,30.29 C5.1 52.71,32.3 R9.1